# Altium project FEU31_Part2.PrjPcb
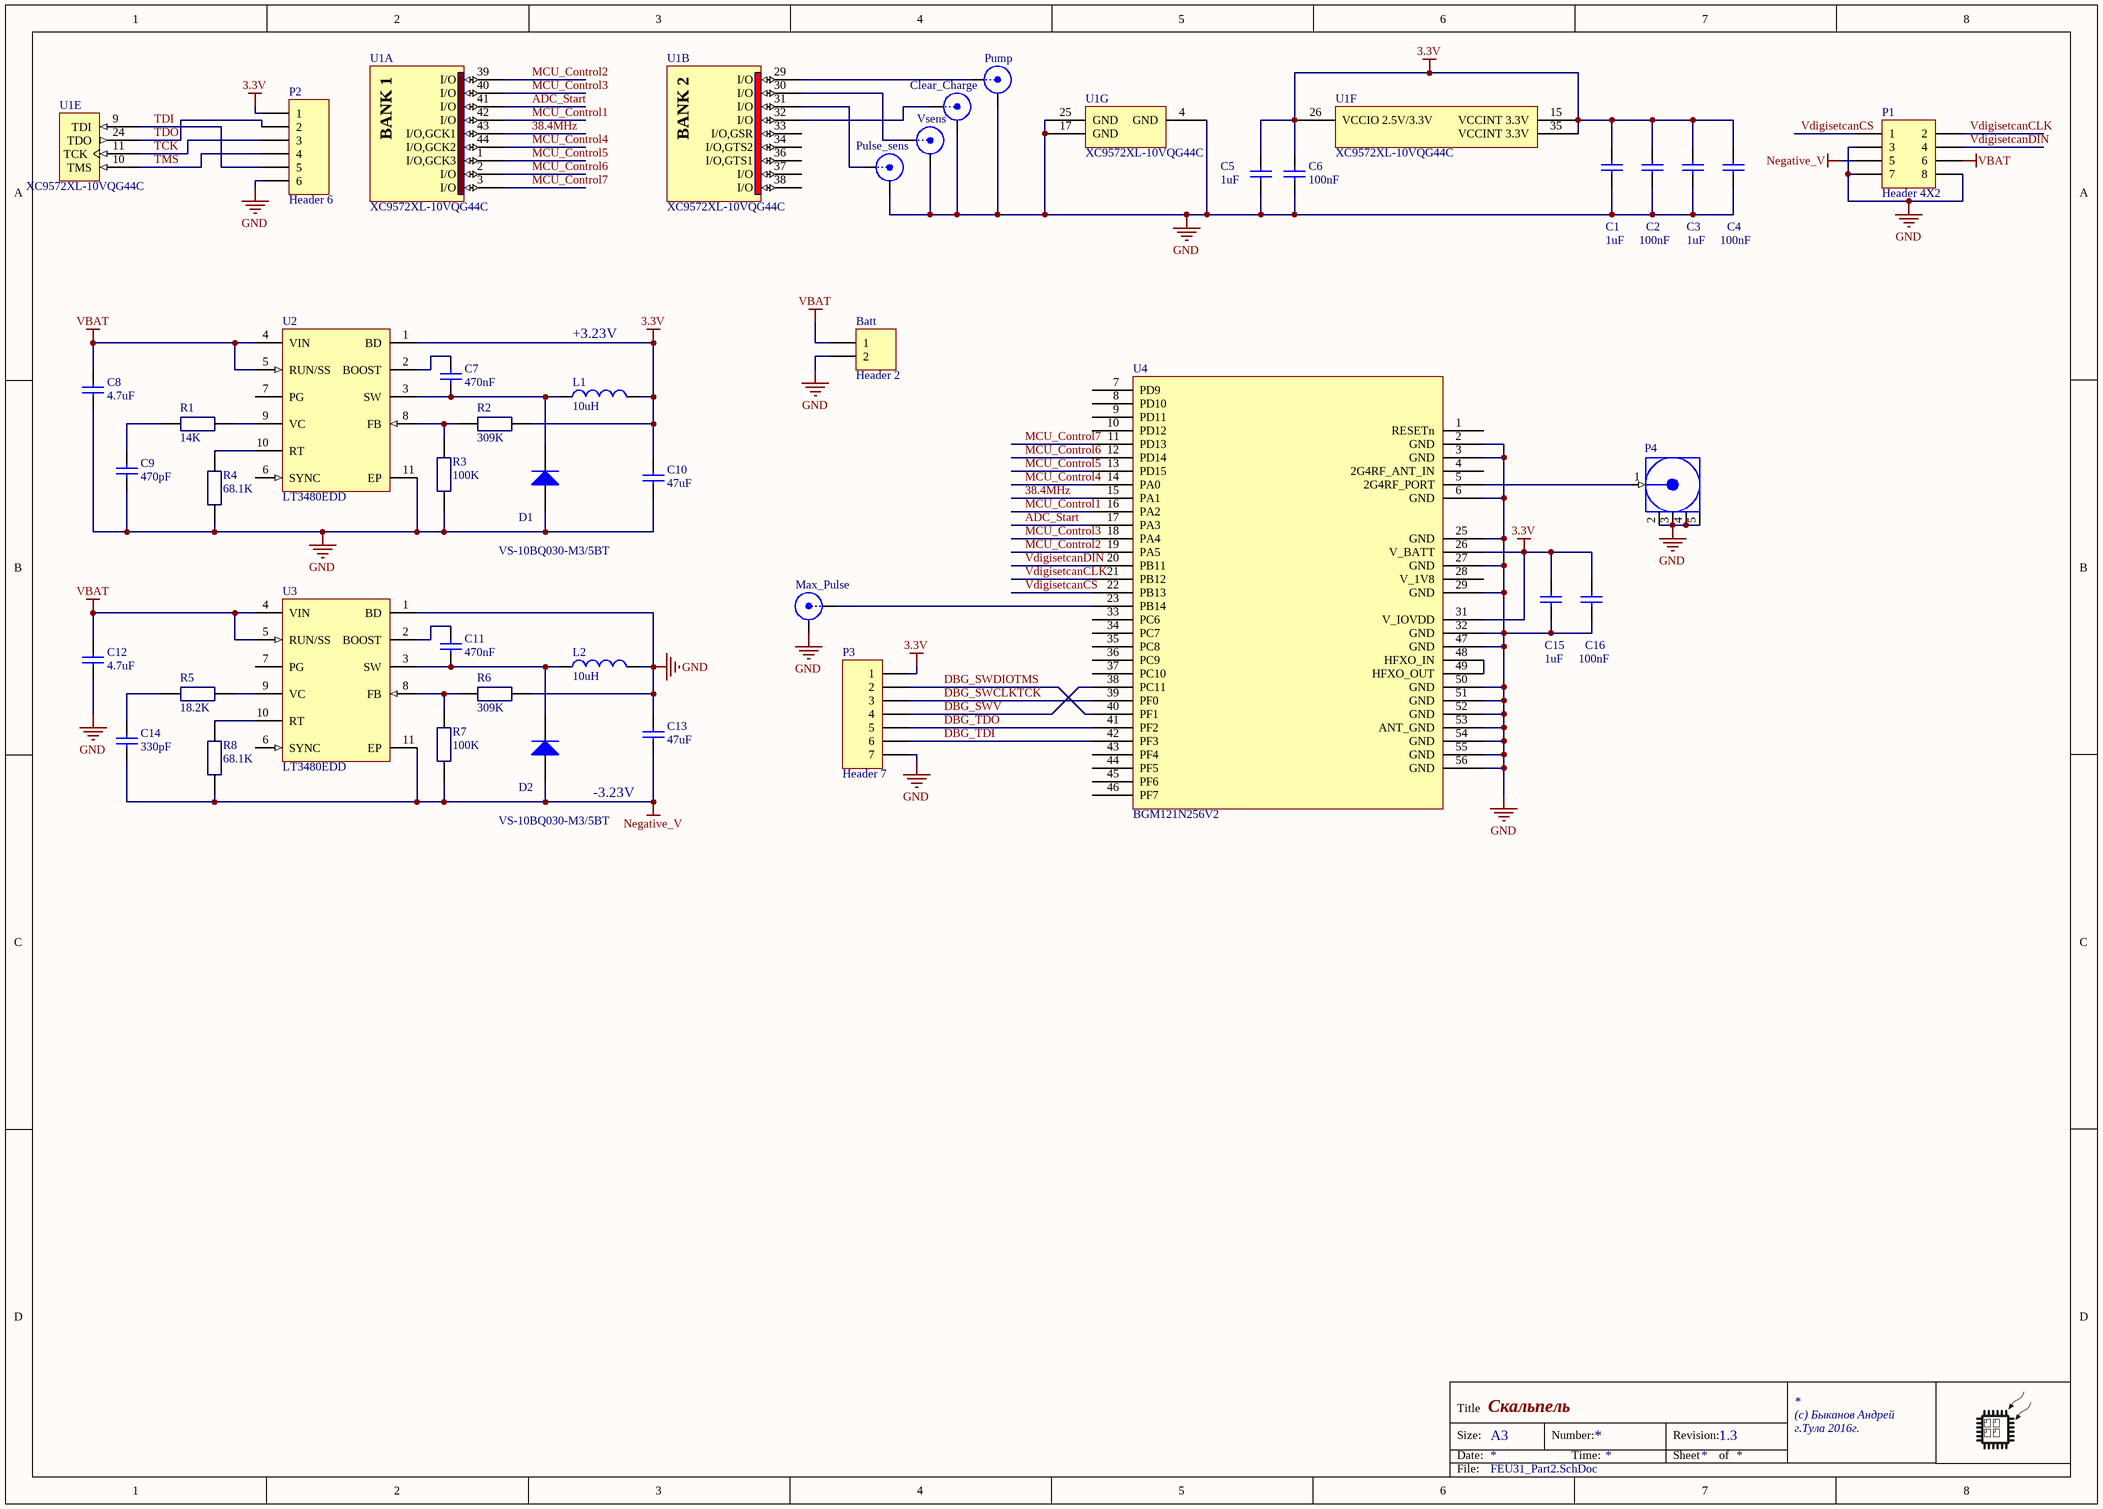
[diagram p0: FEU31_Part2.SchDoc]
1 sheet, 42 parts. Net scope: global (net labels, ports and power ports of the same name join across sheets).
Board file: 2_Lay_PCB.PcbDoc

## Sheet FEU31_Part2.SchDoc: Скальпель
size A3; Address1: (с) Быканов Андрей; Address2: г.Тула 2016г.; Revision: 1.3

### Parts
Batt  Header 2  [HDR1X2]
C1  1uF  [1608[0603]_CAP]
C2  100nF  [1608[0603]_CAP]
C3  1uF  [1608[0603]_CAP]
C4  100nF  [1608[0603]_CAP]
C5  1uF  [1608[0603]_CAP]
C6  100nF  [1608[0603]_CAP]
C7  470nF  [1608[0603]_CAP]
C8  4.7uF  [C1206]
C9  470pF  [1608[0603]_CAP]
C10  47uF  [C1206]
C11  470nF  [1608[0603]_CAP]
C12  4.7uF  [C1206]
C13  47uF  [C1206]
C14  330pF  [1608[0603]_CAP]
C15  1uF  [1608[0603]_CAP]
C16  100nF  [1608[0603]_CAP]
Clear_Charge  MMCX  [MMCX PCB]  (value not drawn)  (no BOM)
D1  VS-10BQ030-M3/5BT  [SMB]
D2  VS-10BQ030-M3/5BT  [SMB]
L1  10uH  [SLF10145]
L2  10uH  [SLF10145]
Max_Pulse  MMCX  [MMCX PCB]  (value not drawn)  (no BOM)
P1  Header 4X2  [HDR2X4]
P2  Header 6  [HDR1X6]
P3  Header 7  [HDR1X7]
P4  COAX-M  [MMCX2.54-V5]  (value not drawn)
Pulse_sens  MMCX  [MMCX PCB]  (value not drawn)  (no BOM)
Pump  MMCX  [MMCX PCB]  (value not drawn)  (no BOM)
R1  14K  [1608[0603]_RES]
R2  309K  [1608[0603]_RES]
R3  100K  [1608[0603]_RES]
R4  68.1K  [1608[0603]_RES]
R5  18.2K  [1608[0603]_RES]
R6  309K  [1608[0603]_RES]
R7  100K  [1608[0603]_RES]
R8  68.1K  [1608[0603]_RES]
U1  XC9572XL-10VQG44C  [VQG44_N]  (parts A,B,E,F,G of 7)
U2  LT3480EDD  [LT-DD-10_V]
U3  LT3480EDD  [LT-DD-10_V]
U4  BGM121N256V2  [BGM121]
Vsens  MMCX  [MMCX PCB]  (value not drawn)  (no BOM)

### Nets
3.3V: C1.1 C2.1 C3.1 C4.1 C5.1 C6.1 C10.1 C15.1 C16.1 L1.2 P2.1 P3.1 R2.2 U1.15(VCCINT_3.3V) U1.26(VCCIO_2.5V/3.3V) U1.35(VCCINT_3.3V) U2.1(BD) U4.26(V_BATT) U4.31(V_IOVDD)
GND: Batt.2 C1.2 C2.2 C3.2 C4.2 C5.2 C6.2 C8.2 C9.2 C10.2 C12.2 C13.1 C15.2 C16.2 Clear_Charge.2(Y) D1.1(A) L2.2 Max_Pulse.2(Y) P1.3 P1.7 P1.8 P2.6 P3.7 P4.2(GND) P4.3(GND) P4.4(GND) P4.5(GND) Pulse_sens.2(Y) Pump.2(Y) R3.1(A) R4.1(A) R6.2 U1.4(GND) U1.17(GND) U1.25(GND) U2.11(EP) U3.1(BD) U4.2(GND) U4.3(GND) U4.6(GND) U4.25(GND) U4.27(GND) U4.29(GND) U4.32(GND) U4.47(GND) U4.50(GND) U4.51(GND) U4.52(GND) U4.53(ANT_GND) U4.54(GND) U4.55(GND) U4.56(GND) Vsens.2(Y)
Negative_V: C13.2 C14.2 D2.1(A) P1.5 R7.1(A) R8.1(A) U3.11(EP)
VBAT: Batt.1 C8.1 C12.1 P1.6 U2.4(VIN) U2.5(RUN/SS) U3.4(VIN) U3.5(RUN/SS)
38.4MHz: U1.43(I/O,GCK1) U4.15(PA1)
ADC_Start: U1.41(I/O) U4.17(PA3)
DBG_SWCLKTCK: P3.3 U4.39(PF0)
DBG_SWDIOTMS: P3.2 U4.40(PF1)
DBG_SWV: P3.4 U4.38(PC11)
DBG_TDI: P3.6 U4.42(PF3)
DBG_TDO: P3.5 U4.41(PF2)
MCU_Control1: U1.42(I/O) U4.16(PA2)
MCU_Control2: U1.39(I/O) U4.19(PA5)
MCU_Control3: U1.40(I/O) U4.18(PA4)
MCU_Control4: U1.44(I/O,GCK2) U4.14(PA0)
MCU_Control5: U1.1(I/O,GCK3) U4.13(PD15)
MCU_Control6: U1.2(I/O) U4.12(PD14)
MCU_Control7: U1.3(I/O) U4.11(PD13)
TCK: P2.3 U1.11(TCK)
TDI: P2.5 U1.9(TDI)
TDO: P2.2 U1.24(TDO)
TMS: P2.4 U1.10(TMS)
VdigisetcanCLK: P1.2 U4.21(PB12)
VdigisetcanCS: P1.1 U4.22(PB13)
VdigisetcanDIN: P1.4 U4.20(PB11)
NetC7_1: C7.1 U2.2(BOOST)
NetC7_2: C7.2 D1.2(K) L1.1 U2.3(SW)
NetC9_1: C9.1 R1.1(A)
NetC11_1: C11.1 U3.2(BOOST)
NetC11_2: C11.2 D2.2(K) L2.1 U3.3(SW)
NetC14_1: C14.1 R5.1(A)
NetClear_Charge_1: Clear_Charge.1(X) U1.32(I/O)
NetMax_Pulse_1: Max_Pulse.1(X) U4.23(PB14)
NetP4_1: P4.1(Signal) U4.5(2G4RF_PORT)
NetPulse_sens_1: Pulse_sens.1(X) U1.31(I/O)
NetPump_1: Pump.1(X) U1.29(I/O)
NetR1_2: R1.2 U2.9(VC)
NetR2_1: R2.1(A) R3.2 U2.8(FB)
NetR4_2: R4.2 U2.10(RT)
NetR5_2: R5.2 U3.9(VC)
NetR6_1: R6.1(A) R7.2 U3.8(FB)
NetR8_2: R8.2 U3.10(RT)
NetU1_30: U1.30(I/O) Vsens.1(X)
NetU4_48: U4.48(HFXO_IN) U4.49(HFXO_OUT)

Not connected (* = marked no-connect by the designer): U1 33(I/O,GSR) 34(I/O,GTS2) 36(I/O,GTS1) 37(I/O) 38(I/O); U2 6(SYNC) 7(PG); U3 6(SYNC) 7(PG); U4 1(RESETn) 4(2G4RF_ANT_IN) 7(PD9) 8(PD10) 9(PD11) 10(PD12) 28(V_1V8) 33(PC6) 34(PC7) 35(PC8) 36(PC9) 37(PC10) 43(PF4) 44(PF5) 45(PF6) 46(PF7)

### Notes on the sheet
- +3.23V
- -3.23V
- Title
- Size:
- Date:
- A3
- Number:
- Time:
- Revision:
- Sheet
- of
- File:
- (in symbol XC9572XL-10VQG44C, part A) BANK 1
- (in symbol XC9572XL-10VQG44C, part B) BANK 2

### Library data of the parts
Batt = Header 2: Header, 2-Pin; LatestRevisionDate: 17-Jul-2002; LatestRevisionNote: Re-released for DXP Platform.; Publisher: Altium Limited
C1 C3 C5 C15 = Cap Semi: Capacitor (Semiconductor SIM Model); Order: CC0603KRX5R7BB105; Published: 8-Jun-2000; LatestRevisionDate: 29-May-2009; LatestRevisionNote: IPC-7351 Footprint Added.; PackageReference: C1206; Publisher: Altium Limited; PackageDescription: Chip Capacitor; Value: 1uF
C2 C4 C6 C16 = Cap Semi: Capacitor (Semiconductor SIM Model); Order: GRM188R72A104KA35D; Published: 8-Jun-2000; LatestRevisionDate: 29-May-2009; LatestRevisionNote: IPC-7351 Footprint Added.; PackageReference: C1206; Publisher: Altium Limited; PackageDescription: Chip Capacitor; Value: 100nF
C7 C11 = Cap Semi: Capacitor (Semiconductor SIM Model); Order: GRM188R71C474KA88D; Published: 8-Jun-2000; LatestRevisionDate: 29-May-2009; LatestRevisionNote: IPC-7351 Footprint Added.; PackageReference: C1206; Publisher: Altium Limited; PackageDescription: Chip Capacitor; Value: 470nF
C8 C12 = Cap Semi: Capacitor (Semiconductor SIM Model); Order: GRM31CR71A475KA01L; Published: 8-Jun-2000; LatestRevisionDate: 29-May-2009; LatestRevisionNote: IPC-7351 Footprint Added.; PackageReference: C1206; Publisher: Altium Limited; PackageDescription: Chip Capacitor; Value: 4.7uF
C9 = Cap Semi: Capacitor (Semiconductor SIM Model); Order: CC0603JRNPO9BN471; Published: 8-Jun-2000; LatestRevisionDate: 29-May-2009; LatestRevisionNote: IPC-7351 Footprint Added.; PackageReference: C1206; Publisher: Altium Limited; PackageDescription: Chip Capacitor; Value: 470pF
C10 C13 = Cap Semi: Capacitor (Semiconductor SIM Model); Order: GRM31CR61A476ME15L; Published: 8-Jun-2000; LatestRevisionDate: 29-May-2009; LatestRevisionNote: IPC-7351 Footprint Added.; PackageReference: C1206; Publisher: Altium Limited; PackageDescription: Chip Capacitor; Value: 47uF
C14 = Cap Semi: Capacitor (Semiconductor SIM Model); Order: GRM1885C1H331JA01D; Published: 8-Jun-2000; LatestRevisionDate: 29-May-2009; LatestRevisionNote: IPC-7351 Footprint Added.; PackageReference: C1206; Publisher: Altium Limited; PackageDescription: Chip Capacitor; Value: 330pF
Clear_Charge Max_Pulse Pulse_sens Pump Vsens = SMB: SMB Straight Connector; LatestRevisionDate: 17-Jul-2002; LatestRevisionNote: Re-released for DXP Platform.; Publisher: Altium Limited
D1 D2 = Diode: Default Diode; Published: 8-Jun-2000; LatestRevisionDate: 17-Jul-2002; LatestRevisionNote: Re-released for DXP Platform.; PackageVersion: Sep-1996; PackageReference: SMC; Publisher: Altium Limited; PackageDescription: DO-214-AB/SMC; 2 C-Bend Leads; Body 7.9 x 5.9 mm, inc. leads (LxW); Code_JEDEC: DO-214-AB; Order: VS-10BQ030-M3/5BT; Value: VS-10BQ030-M3/5BT
L1 L2 = Inductor: Code_IEC: 1005; Order: SLF10145T-100M2R5-PF; Published: 8-Jun-2000; LatestRevisionDate: 29-May-2009; LatestRevisionNote: IPC-7351 Footprint Added.; PackageReference: 0402-A; Publisher: Altium Limited; PackageDescription: Chip Inductor; Code_JEITA: 0402; Value: 10uH
P1 = Header 4X2: Header, 4-Pin, Dual row; LatestRevisionDate: 17-Jul-2002; LatestRevisionNote: Re-released for DXP Platform.; Publisher: Altium Limited
P2 = Header 6: Header, 6-Pin; LatestRevisionDate: 17-Jul-2002; LatestRevisionNote: Re-released for DXP Platform.; Publisher: Altium Limited
P3 = Header 7: Header, 7-Pin; LatestRevisionDate: 17-Jul-2002; LatestRevisionNote: Re-released for DXP Platform.; Publisher: Altium Limited
P4 = COAX-M: RF Coaxial PCB Connector, MMCX; Thru-Hole, Vertical Mount Plug,  50 Ohm Impedance; PackageDocument: Rev. A, 16-Jun-1997; PCB_Layout: Complies with manufacturer's recommendation.; DrillSize: Corresponds to nominal value.; Published: 15-Jul-2004; LatestRevisionDate: 15-Jul-2004; LatestRevisionNote: Component Replaced.; DatasheetDocument: 30-May-2003; PackageReference: 908-21103; Publisher: Altium Limited; ComponentLink1Description: Manufacturer Link; ComponentLink1URL: http://www.amphenolrf.com/
R1 R5 = Resistor 0805: Order: ERA-3AEB1402V; Avail: 20
  R1: Value: 14K
  R5: Value: 18.2K
R2 R6 = Resistor 0805: Order: ERA-3AEB3093V; Avail: 20; Value: 309K
R3 R7 = Resistor 0805: Order: ERA-3AEB104V; Avail: 20; Value: 100K
R4 R8 = Resistor 0805: Order: ERA-3AEB6812V; Avail: 20; Value: 68.1K
U1 = XC9572XL-10VQG44C: FastFLASH XC900XL, 3.3V High-Performance 72 Macrocell CPLD, 34 User I/Os, 44-Pin VQFP, Speed Grade 10, Commercial Grade, Pb-Free; Published: 8-Sep-2006; LatestRevisionDate: 18-Nov-2009; LatestRevisionNote: Updated to datasheet version 2.5 May-2009.; DatasheetVersion: ver2.0 Apr-2007; PackageVersion: ver1.2, Jun-2004; PackageReference: VQG44; Publisher: Altium Limited; PackageDescription: 44-Pin Very Thin Quad Flat Pack (VQG44) - Pb-Free; Supplier 1: Digi-Key; Supplier Part Number 1: 122-1448-ND; Supplier 2: Farnell; Supplier Part Number 2: 1605849; Supplier 3: Newark; Supplier Part Number 3: 12N2472; Code_JEDEC: MS-026-ACB; ComponentLink1Description: XC9572XL Datasheet; ComponentLink1URL: http://www.xilinx.com/support/documentation/data_sheets/ds057.pdf; ComponentLink2Description: VQG44 Package Drawing; ComponentLink2URL: http://www.xilinx.com/support/documentation/package_specs/vq44.pdf; ComponentLink3Description: XC9500XL Documents; ComponentLink3URL: http://www.xilinx.com/support/documentation/xc9500xl.htm; ComponentLink4Description: Xilinx.com Home; ComponentLink4URL: http://www.xilinx.com; Order: XC9572XL-10VQG44C
U2 U3 = LT3480EDD#PBF: 2 A, 2.4 MHz Step-Down Switching Regulator with 70 uA Quiescent Current, 10-pin SON (DD-10), -40 to 85 degC, Pb-Free; Manufacturer: Linear Technology; Number of Outputs: 1; Over Voltage Protection(V): 60; PackageVersion: Rev. C, 06/2010; PackageReference: DD-10; PackageDescription: 10-Pin Plastic DFN, Body 3 x 3 mm, Pitch 0.5 mm; Supplier 1: Digi-Key; Supplier Part Number 1: LT3480EDD#PBF-ND; Supplier 2: Farnell; Supplier Part Number 2: 1663561; Supplier 3: Newark; Supplier Part Number 3: 57M8341; RoHS: TRUE; Mounting Technology: Surface Mount; Code_JEDEC: MO-229; PartNumber: LT3480EDD#PBF; ComponentLink1Description: Manufacturer URL; ComponentLink1URL: http://www.linear.com/; ComponentLink2Description: Datasheet; ComponentLink2URL: http://cds.linear.com/docs/en/datasheet/3480fe.pdf; ComponentLink3Description: Package Specification; ComponentLink3URL: http://cds.linear.com/docs/en/packaging/DFN_10_05-08-1699.pdf; Order: LT3480EDD
U4 = BGM121: Order: BGM121N256V2